# EAGLE schematic GPS_modul (EAGLE 7.1.0)
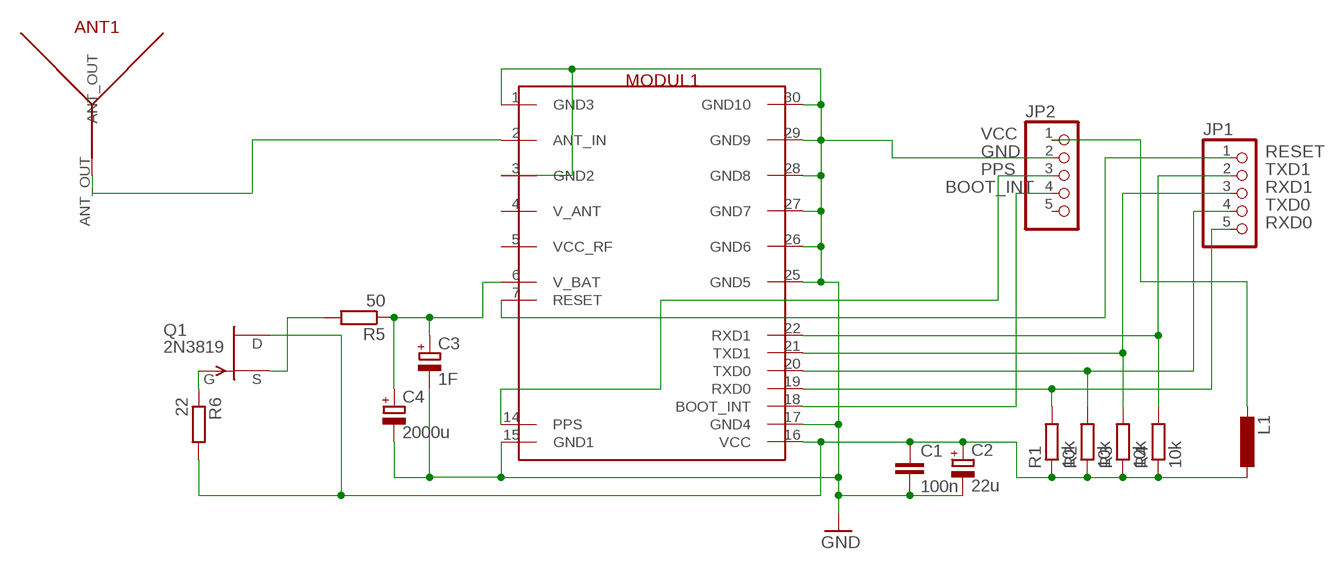
[diagram p0: schematic, sheet 1]

## Parts
ANT1  GPS_ANTDEFAULT  [GPS_ANT_CERAMIC]
C1  100n  C-EUC0805K  [C0805K]
C2  22u  CPOL-EU153CLV-0605  [153CLV-0605]
C3  1F  CPOL-EUE10-20  [EB20D]
C4  2000u  CPOL-EUE10-20  [EB20D]
JP1  PINHD-1X5  [1X05]
JP2  PINHD-1X5  [1X05]
L1  L-EUL3225P  [L3225P]
MODUL1  SKYNAV_GM25DEFAULT  [SMD_SKYNAV_GM25]
Q1  2N3819  [TO92]
R1  10k  R-EU_R1206  [R1206]
R2  10k  R-EU_R1206  [R1206]
R3  10k  R-EU_R1206  [R1206]
R4  10k  R-EU_R1206  [R1206]
R5  50  R-EU_0204/7  [0204/7]
R6  22  R-EU_0204/7  [0204/7]

## Nets
BOOT_INT: JP2.4 MODUL1.18(BOOT_INT)
GND: C1.2 C2.- C3.- C4.- JP2.2 MODUL1.1(GND3) MODUL1.3(GND2) MODUL1.15(GND1) MODUL1.17(GND4) MODUL1.25(GND5) MODUL1.26(GND6) MODUL1.27(GND7) MODUL1.28(GND8) MODUL1.29(GND9) MODUL1.30(GND10)
N$1: C1.1 C2.+ L1.1 MODUL1.16(VCC) Q1.1(D) R1.1 R2.1 R3.1 R4.1 R6.2
N$14: ANT1.ANT_OUT MODUL1.2(ANT_IN)
N$15: C3.+ C4.+ MODUL1.6(V_BAT) R5.1
N$16: Q1.3(S) R5.2
N$17: Q1.2(G) R6.1
PPS: JP2.3 MODUL1.14(PPS)
RESET: JP1.1 MODUL1.7(RESET)
RXD0: JP1.5 MODUL1.19(RXD0) R1.2
RXD1: JP1.2 MODUL1.22(RXD1) R4.2
TXD0: JP1.4 MODUL1.20(TXD0) R2.2
TXD1: JP1.3 MODUL1.21(TXD1) R3.2
VCC: JP2.1 L1.2
Unconnected: JP2.5 MODUL1.4(V_ANT) MODUL1.5(VCC_RF)

## Library data of the parts
ANT1 = GPS_antenna_ceramic:GPS_ANT
C1 = rcl:C-EU: CAPACITOR, European symbol
C2-C4 = rcl:CPOL-EU: POLARIZED CAPACITOR, European symbol
JP1 JP2 = pinhead:PINHD-1X5: PIN HEADER
L1 = rcl:L-EU: INDUCTOR, European symbol
MODUL1 = skynav_gm25:SKYNAV_GM25
Q1 = transistor-fet:2N3819: N-Channel Junction FET
R1-R6 = rcl:R-EU_: RESISTOR, European symbol